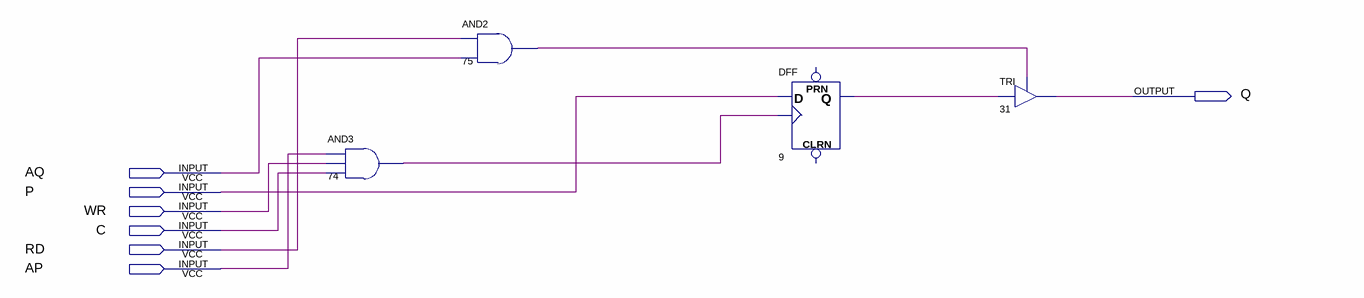
[diagram p0: schematic sheet]
// Quartus schematic FMi.bdf as structural Verilog: 4 symbols, 7 pins
module FMi (
  input  AQ,
  input  P,
  input  WR,
  input  C,
  input  RD,
  input  AP,
  output Q
);

  wire n9_q, n74_out, n75_out;

  and u_74 (n74_out, AP, WR, C);
  and u_75 (n75_out, RD, AQ);
  DFF u_9 (.CLK(n74_out), .D(P), .Q(n9_q));  // open: CLRN, PRN
  TRI u_31 (.IN(n9_q), .OE(n75_out), .OUT(Q));
endmodule
